# EAGLE design robotarium-1 (EAGLE 9.5.1)
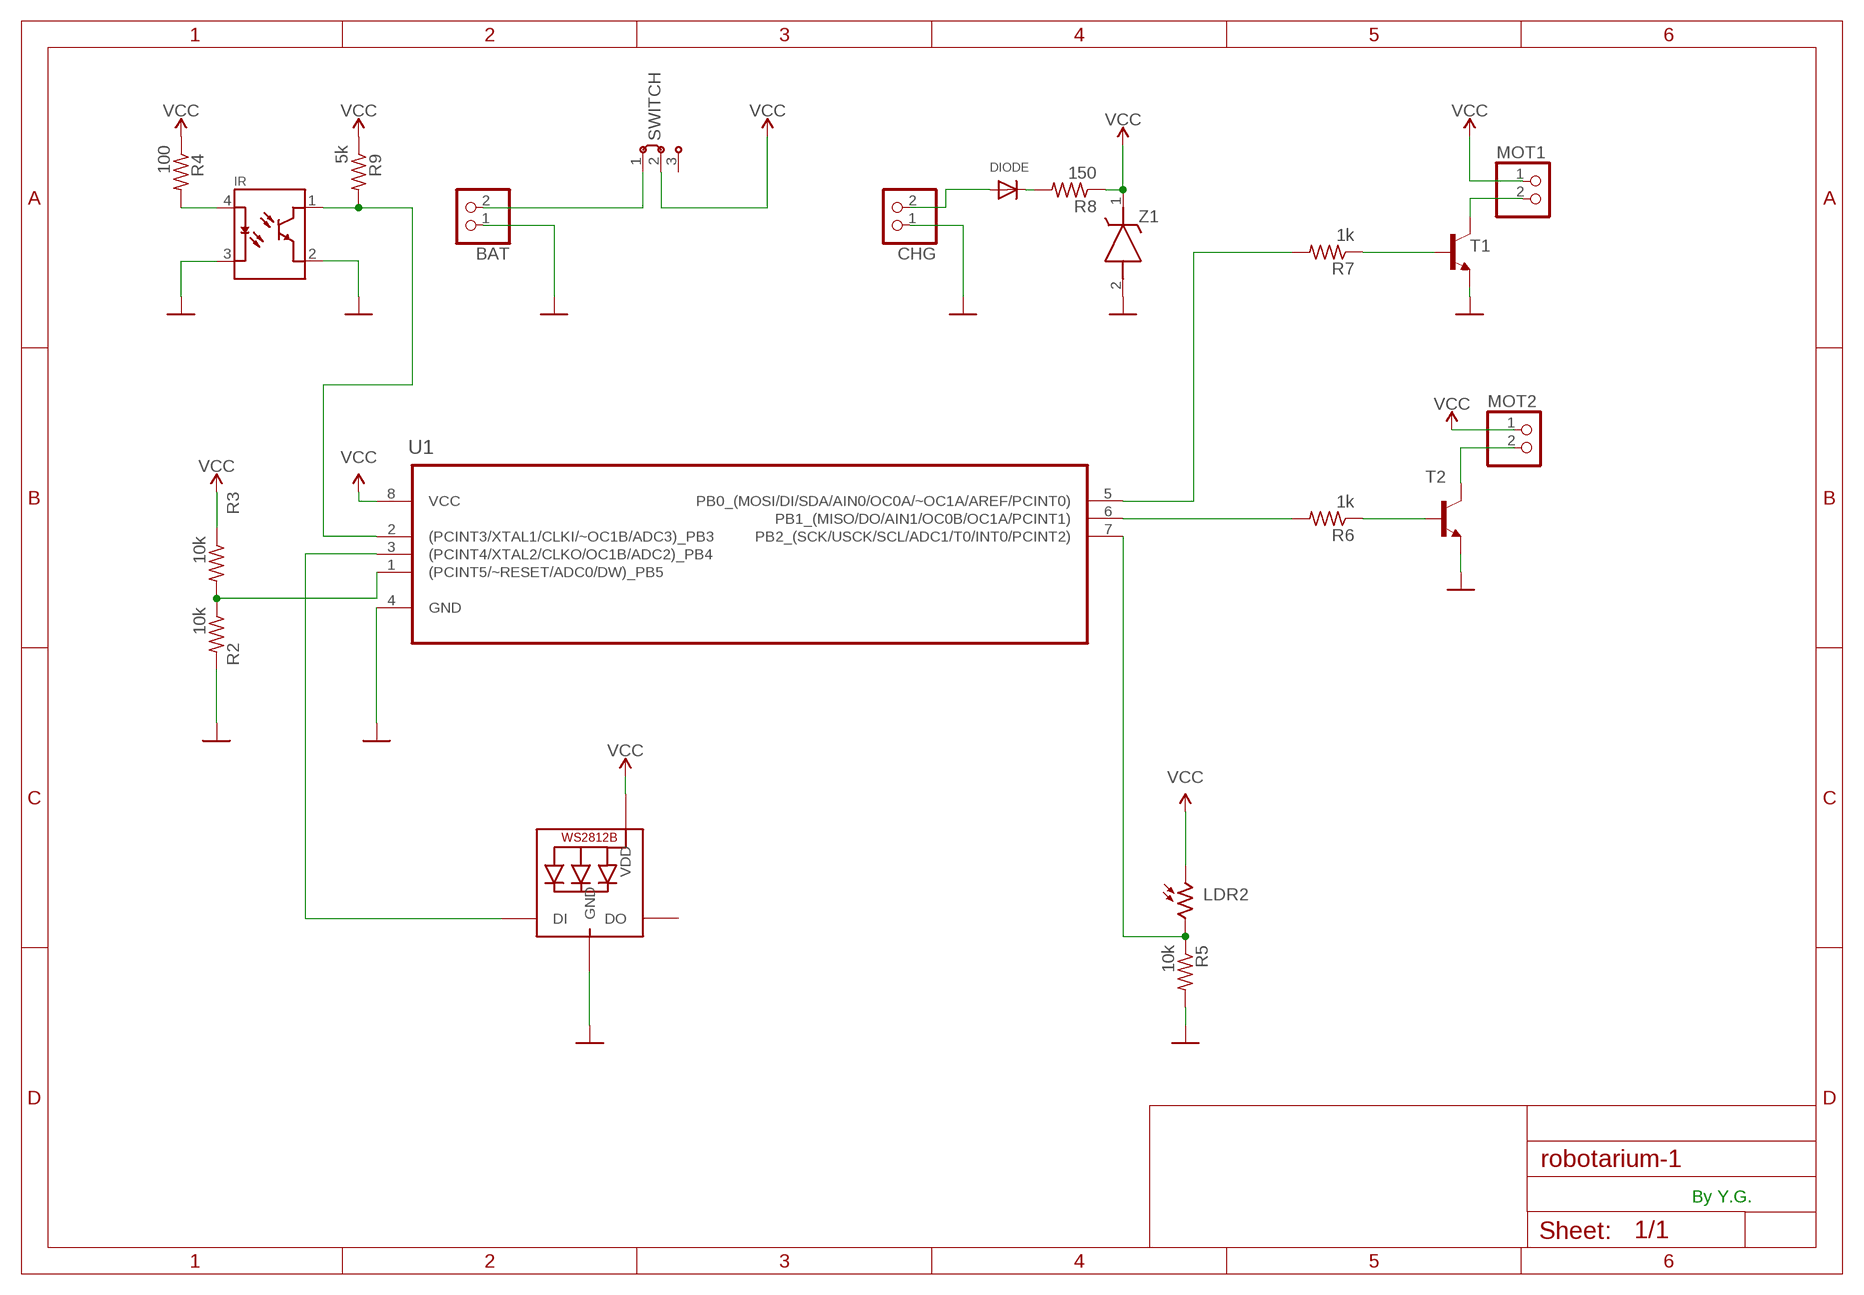
[diagram p0: schematic, sheet 1]
FRAME1 (A4L-LOC): AUTHOR: Y.

## Parts
BAT  PINHD-1X2  [1X02]
CHG  PINHD-1X2  [1X02]
DIODE  DIODEDO-1N4148  [DO-1N4148]
IR  TCRT5000L  [XDCR_TCRT5000L]
LDR2  A1050_14  [T0-46-A10XX]
LED2  WS2812B5050  [WS2812B]
MOT1  PINHD-1X2  [1X02]
MOT2  PINHD-1X2  [1X02]
R2  10k  R-US_0207/10  [0207/10]
R3  10k  R-US_0207/10  [0207/10]
R4  100  R-US_0207/10  [0207/10]
R5  10k  R-US_0207/10  [0207/10]
R6  1k  R-US_0207/10  [0207/10]
R7  1k  R-US_0207/10  [0207/10]
R8  150  R-US_0207/10  [0207/10]
R9  5k  R-US_0207/10  [0207/10]
SWITCH  J2X2MM  [04C]
T1  2N3904  [TO92]
T2  2N3904  [TO92]
U1  ATTINY85-20PU  [DIP254P762X533-8]
Z1  BZX55C10  [DIOAD950W60L350D150]

## Nets
GND: BAT.1 CHG.1 IR.2(E) IR.3(C) LED2.3-GND(GND) R2.2 R5.2 T1.3(E) T2.3(E) U1.4(GND) Z1.2(A)
N$2: R6.1 T2.2(B)
N$3: R7.1 T1.2(B)
N$4: R2.1 R3.2 U1.1((PCINT5/~RESET/ADC0/DW)_PB5)
N$5: IR.1(CO) R9.2 U1.2((PCINT3/XTAL1/CLKI/~OC1B/ADC3)_PB3)
N$6: LDR2.2 R5.1 U1.7(PB2_(SCK/USCK/SCL/ADC1/T0/INT0/PCINT2))
N$7: BAT.2 SWITCH.1
N$8: CHG.2 DIODE.A
N$9: LED2.4-DIN(DI) U1.3((PCINT4/XTAL2/CLKO/OC1B/ADC2)_PB4)
N$10: MOT2.2 T2.1(C)
N$11: R7.2 U1.5(PB0_(MOSI/DI/SDA/AIN0/OC0A/~OC1A/AREF/PCINT0))
N$12: R6.2 U1.6(PB1_(MISO/DO/AIN1/OC0B/OC1A/PCINT1))
N$13: MOT1.2 T1.1(C)
N$14: DIODE.C R8.2
N$15: IR.4(A) R4.2
VCC: LDR2.1 LED2.1-VDD(VDD) MOT1.1 MOT2.1 R3.1 R4.1 R8.1 R9.1 SWITCH.2 U1.8(VCC) Z1.1(K)
Unconnected: LED2.2-DOUT(DO) SWITCH.3

## Notes on the sheet
- By Y.G.

## Library data of the parts
BAT CHG MOT1 MOT2 = pinhead:PINHD-1X2: PIN HEADER
DIODE = adafruit:DIODE: Diode SMADIODE - SMA Surface Mount Package 20V 1A Schottky Diode Digikey: 641-1014-6-ND DO-1N4148 - Through Hole Small Current Diode SOD-123 20V 1 A (.5mV Vf) Schottky Diode - Digikey: MBRX120TPMSCT-ND SOD-323 10V 570mA (.38mV Vf, 3ns) Schottky Diode - Digikey: ZLLS410CT-ND SOD-523 30V 30mA Schottky Diode (RB751S-40TE61) - Digikey: RB751S-40TE61CT-ND SOT23-R/W - SOT23 Package (R = Solder Paste/Reflow Ovens, W = Hand-Soldering) BAT54Film 40V 300mA - Digikey: 497-7162-1-ND
IR = TCRT5000L:TCRT5000L: TCRT5000 Series 940 nm 100 mA 60 mA Transistor Output Reflective Optical Sensor; AVAILABILITY: Unavailable; DESCRIPTION: Photointerrupter Reflective Phototransistor 4-Pin Tube; MF: Vishay; MP: TCRT5000L; PACKAGE: PCB Mount Vishay Semiconductor; PRICE: None
LDR2 = photo-elements:A10: Sensor Robust Light Sensing Applications Outdoor Light Sensing Application Source: http://optoelectronics.perkinelmer.com/content/Datasheets/DTS_PhotocellsA1050.pdf
LED2 = WS2812B:WS2812B; AVAILABILITY: Unavailable; DESCRIPTION: Intelligent Control Led Integrated Light Source Pack Of 10; MF: SparkFun Electronics; MP: WS2812B; PACKAGE: None; PRICE: None
R2-R9 = adafruit:R-US_: RESISTOR, American symbol
SWITCH = new-switch:J2: Jumper switch 2 x 2.5 mm
T1 T2 = new-t:2N3904: NPN TRANSISTOR
U1 = ATTINY85-20PU:ATTINY85-20PU: 8-bit Microcontroller with In-System Programmable Flash; AVAILABILITY: Unavailable; DESCRIPTION: ATtiny Series 20 MHz 8 KB Flash 512 B SRAM 8-Bit Microcontroller - DIP-8; MF: Microchip; MP: ATTINY85-20PU; PACKAGE: DIP-8 Microchip; PRICE: None
Z1 = BZX55C10:BZX55C10: Zener diode, 10V, 500mW, DO-35 Source: Datasheet <http://www.vishay.com/docs/85604/bzx55-se.pdf>; DESCRIPTION: BZX55 Series 10 V ±5 % 500 mW Through Hole Small Signal Zener Diode - DO-35; DIGI-KEY_PART_NUMBER: BZX55C10-GICT-ND; DIGI-KEY_PURCHASE_URL: https://www.digikey.hk/product-detail/en/vishay-semiconductor-diodes-division/BZX55C10-TR/BZX55C10-GICT-ND/6228440?utm_source=snapeda&utm_medium=aggregator&utm_campaign=symbol; MF: Vishay Semiconductor; MP: BZX55C10-TR; PACKAGE: DO-35 Vishay Semiconductor

## Board
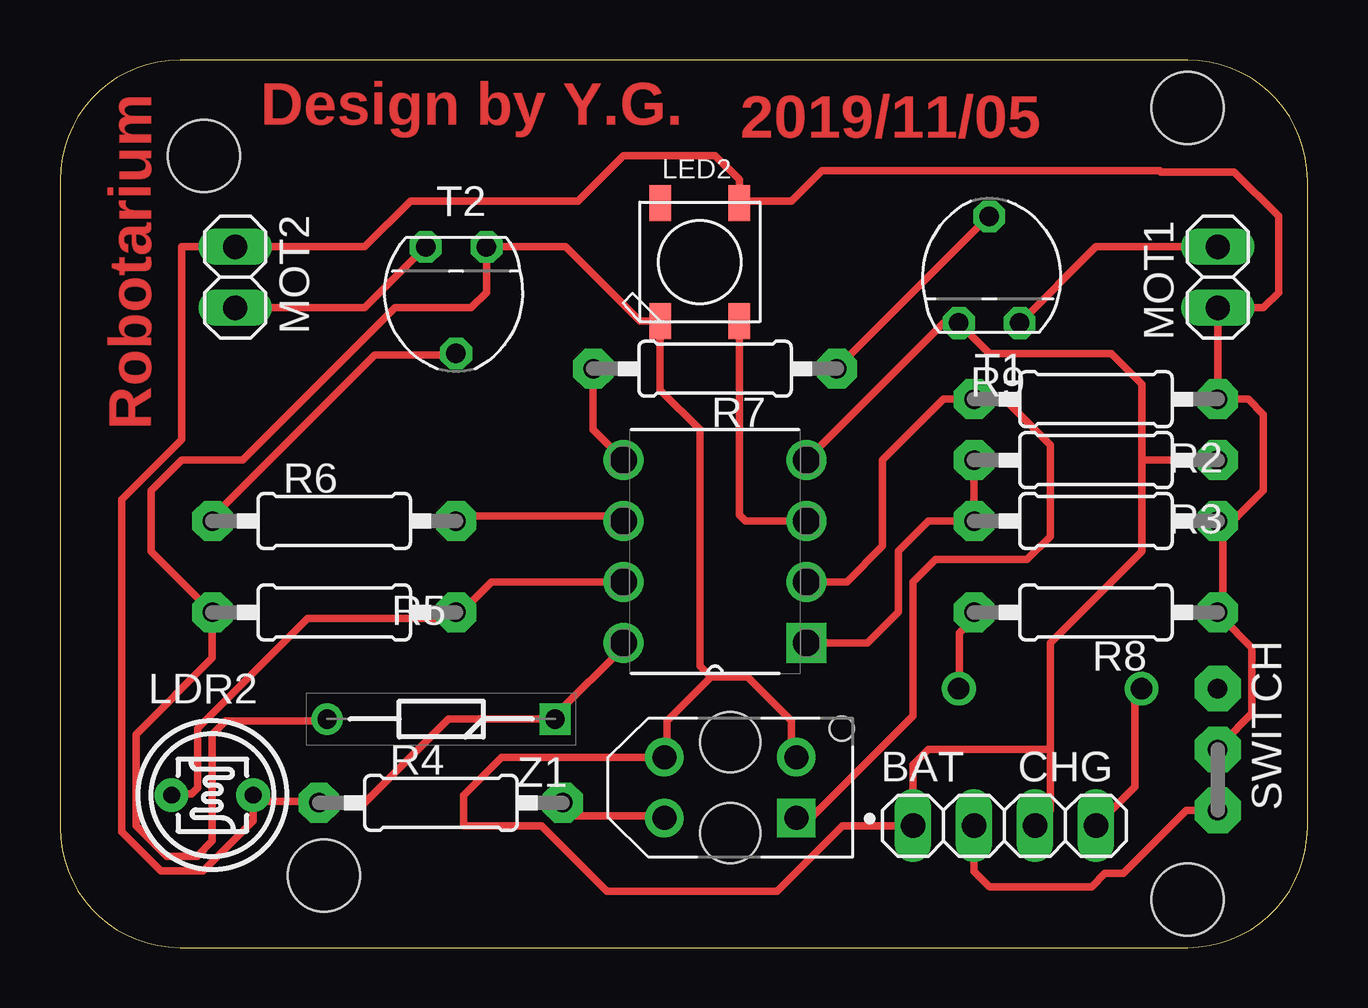
[diagram p1: board, top side]
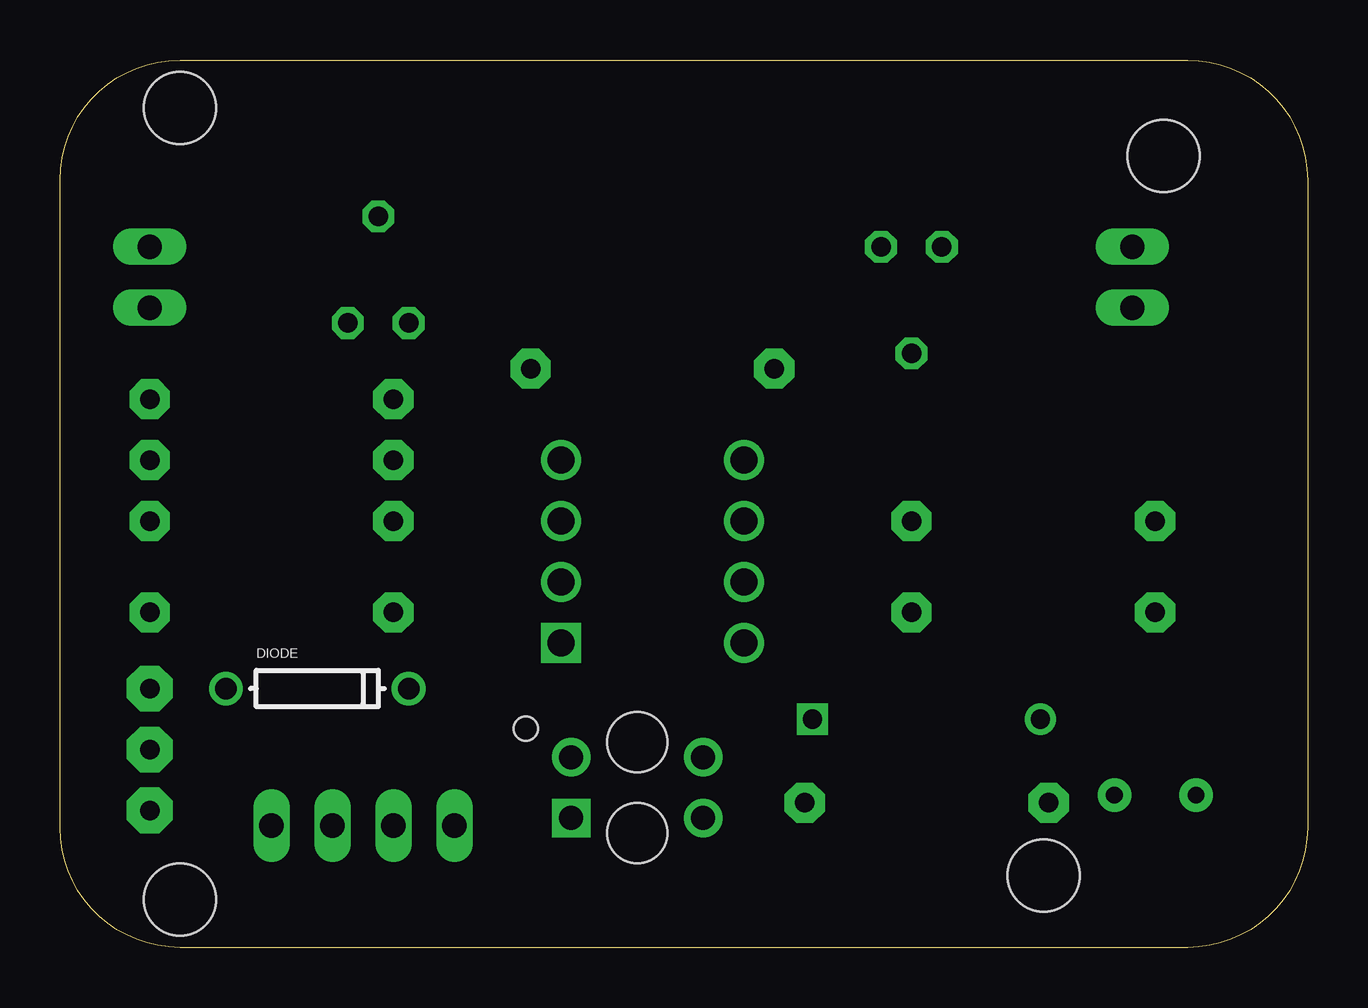
[diagram p2: board, bottom side, seen from below]

Size 52 x 37 mm. Coordinates in mm from the lower left corner, seen from the top.
Outline: 52,5 52,32 arc90 47,37 5,37 arc90 0,32 0,5 arc90 5,0 47,0 arc90 52,5
Copper layers (1*16): Top 0.035mm / dielectric 1.5mm / Bottom 0.035mm
Design rules "default *": minimum track width 12mil, minimum drill 0.35mm, track to track 12mil, track to pad 12mil, pad to pad 12mil, via to via 12mil, smd to smd 6mil, copper to edge 40mil, drill to drill 6mil, minimum pad ring 10mil, minimum via ring 8mil, stop-mask expansion 4mil, vias tented up to drill 0mil, thermal gap 10mil
Holes 3 mm at 6,33 47,35 47,2 11,3

### Footprints (pad centres in the part's own frame; a part is rotated, then mirrored left to right if it is on the bottom)
1X02 = drill 1.016 long: 1 -1.27,0; 2 1.27,0
DO-1N4148 = drill 0.9: A -3.81,0; C 3.81,0
XDCR_TCRT5000L = drill 1 pad 1.6 square: 1 -2.75,1.27 | drill 1 pad 1.6: 2 -2.75,-1.27; 3 2.75,-1.27; 4 2.75,1.27 | hole 2.5: 0,1.9; 0,-1.9 | hole 1: -4.65,-2.45
T0-46-A10XX = drill 0.7 pad 1.4: 1 -1.7,0; 2 1.7,0
WS2812B = smd 1.5 x 0.9: 1-VDD 2.45,-1.65; 2-DOUT 2.45,1.65; 3-GND -2.45,1.65; 4-DIN -2.45,-1.65
0207/10 = drill 0.813 pad 1.676 octagon: 1 -5.08,0; 2 5.08,0
04C = drill 0.813 pad 1.905 octagon: 1 -0.635,0; 2 1.905,0; 3 4.445,0
TO92 = drill 0.813 octagon: 1 1.27,-2.54; 2 0,1.905; 3 -1.27,-2.54
DIP254P762X533-8 = drill 1.118 square: 1 -7.62,7.62 | drill 1.118: 2 -7.62,5.08; 3 -7.62,2.54; 4 -7.62,0; 5 0,0; 6 0,2.54; 7 0,5.08; 8 0,7.62
DIOAD950W60L350D150 = drill 0.8 pad 1.2 square: 1 0,0 | drill 0.8 pad 1.2: 2 9.5,0

### Placement (x,y rotation side)
BAT  36.83,5.08 0 top
CHG  41.91,5.08 0 top
DIODE  41.27,10.79 0 bottom
IR  27.94,6.67 180 top
LDR2  6.35,6.35 180 top
LED2  26.67,28.57 90 top
MOT1  48.26,27.94 90 top
MOT2  7.3,27.94 270 top
R2  43.18,20.32 0 top
R3  43.18,17.78 180 top
R4  15.88,6.03 0 top
R5  11.43,13.97 180 top
R6  11.43,17.78 0 top
R7  27.3,24.13 180 top
R8  43.18,13.97 180 top
R9  43.18,22.86 180 top
SWITCH  48.26,6.35 90 top
T1  38.73,28.57 0 top
T2  16.51,26.67 180 top
U1  23.5,20.32 180 top
Z1  20.64,9.53 180 top

### Tracks (layer width: path | path; a pad name or v marks a point on that pad's centre or on a via)
GND
  Top 0.305: Z1.2 10.97,9.45 6.91,9.45 6.35,8.89 6.35,4.45 5.71,3.81 4.45,3.81 3.17,5.08 3.17,8.89 6.35,12.06 R5.2 3.81,16.51 3.81,19.05 5.08,20.32 7.62,20.32 13.97,26.67 17.14,26.67 17.78,27.3 T2.3 21.08,29.21 24.17,26.12 LED2.3-GND 25.02,23.24 26.67,21.59 26.67,11.73 27.13,11.28 | 27.13,11.28 25.3,9.45 25.3,8.23 IR.3 24.99,7.92 18.41,7.92 16.83,6.34 16.83,5.08 20.08,5.08 22.81,2.35 29.89,2.35 32.62,5.08 BAT.1 35.56,7.62 36.2,8.26 41.27,8.26 | 27.13,11.28 28.65,11.28 30.48,9.45 30.48,8.23 IR.2 | 41.27,8.26 41.27,5.71 CHG.1 | 45.09,20.32 R2.2 | 45.09,20.32 45.09,23.5 43.81,24.77 38.73,24.77 T1.3 36.83,26.04 U1.4 | 41.27,8.26 41.27,12.7 45.09,16.51 45.09,20.32
N$2
  Top 0.305: T2.2 16.46,24.69 13.11,24.69 6.4,17.98 R6.1
N$3
  Top 0.305: R7.1 32.61,24.38 38.71,30.48 T1.2
N$4
  Top 0.305: 31.09,12.8 U1.1 33.66,12.7 34.95,13.99 34.95,16.54 36.2,17.78 R3.2 R2.1
N$5
  Top 0.305: IR.1 30.79,5.49 31.39,5.49 35.56,9.65 35.56,15.24 36.5,16.18 40.31,16.18 41.27,17.14 41.27,20.95 39.37,22.86 R9.2 36.83,22.86 34.29,20.32 34.29,16.74 32.79,15.24 U1.2 32,15.24
N$6
  Top 0.305: LDR2.2 4.88,6.4 5.49,6.4 5.74,6.66 5.74,9.14 6.55,9.96 6.66,10.06 10.31,13.72 12.8,13.72 13.34,13.72 16.46,13.72 R5.1 16.76,14.02 17.98,15.24 U1.7
N$7
  Top 0.305: 38.1,4.88 BAT.2 38.1,3.17 38.73,2.54 43,2.54 43.56,3.1 44.33,3.1 46.94,5.71 SWITCH.1 48.16,5.49
N$8
  Top 0.305: CHG.2 44.81,6.71 44.81,10.67 DIODE.A
N$9
  Top 0.305: LED2.4-DIN 28.32,18.04 28.57,17.78 U1.3
N$10
  Top 0.305: MOT2.2 12.7,26.67 T2.1
N$11
  Top 0.305: 23.47,20.42 U1.5 22.23,21.59 R7.2
N$12
  Top 0.305: R6.2 16.76,17.98 23.47,17.98 U1.6
N$13
  Top 0.305: 48.16,29.21 MOT1.2 43.18,29.21 T1.1
N$14
  Top 0.305: DIODE.C 37.49,10.97 37.49,13.11 38.1,13.72 R8.2
N$15
  Top 0.305: IR.4 24.99,5.49 21.34,5.49 21.03,5.79 R4.2
VCC
  Top 0.305: LDR2.1 8.23,6.1 10.67,6.1 R4.1 | Z1.1 20.73,9.75 23.47,12.5 U1.8 | 10.97,6.1 R4.1 | 20.42,9.45 Z1.1 | 48.46,22.91 R9.1 | R3.1 48.46,17.68 48.46,14.02 R8.1 48.46,13.72 49.68,12.5 49.68,9.75 48.46,8.53 SWITCH.2 | R9.1 48.46,22.61 48.72,22.86 49.53,22.86 50.16,22.23 50.16,19.05 48.9,17.78 R3.1 | 48.46,17.98 R3.1 | 7.92,6.1 LDR2.1 | LDR2.1 8.05,5.28 5.97,3.2 4.19,3.2 2.56,4.83 2.56,18.67 5.08,21.18 5.08,29.21 MOT2.1 12.7,29.21 14.61,31.11 21.59,31.11 23.5,33.02 27.3,33.02 28.32,32.01 LED2.1-VDD 28.32,31.11 30.48,31.11 31.75,32.38 45.84,32.38 45.9,32.33 48.95,32.33 50.8,30.48 50.8,27.3 50.16,26.67 MOT1.1 R9.1 | R4.1 12.7,6.03 16.19,9.53 Z1.1

### Text on the board
Top: Design by Y.G. | 2019/11/05 | Robotarium